# EasyEDA Pro project ProPrj_4pin风扇调速_2025-03-10.epro

# Schematic Schematic1
Create Date: 2024-08-04; Page Name: P1; Project Name: 4pin风扇调速; Schematic Name: Schematic1; Update Date: 2024-08-04
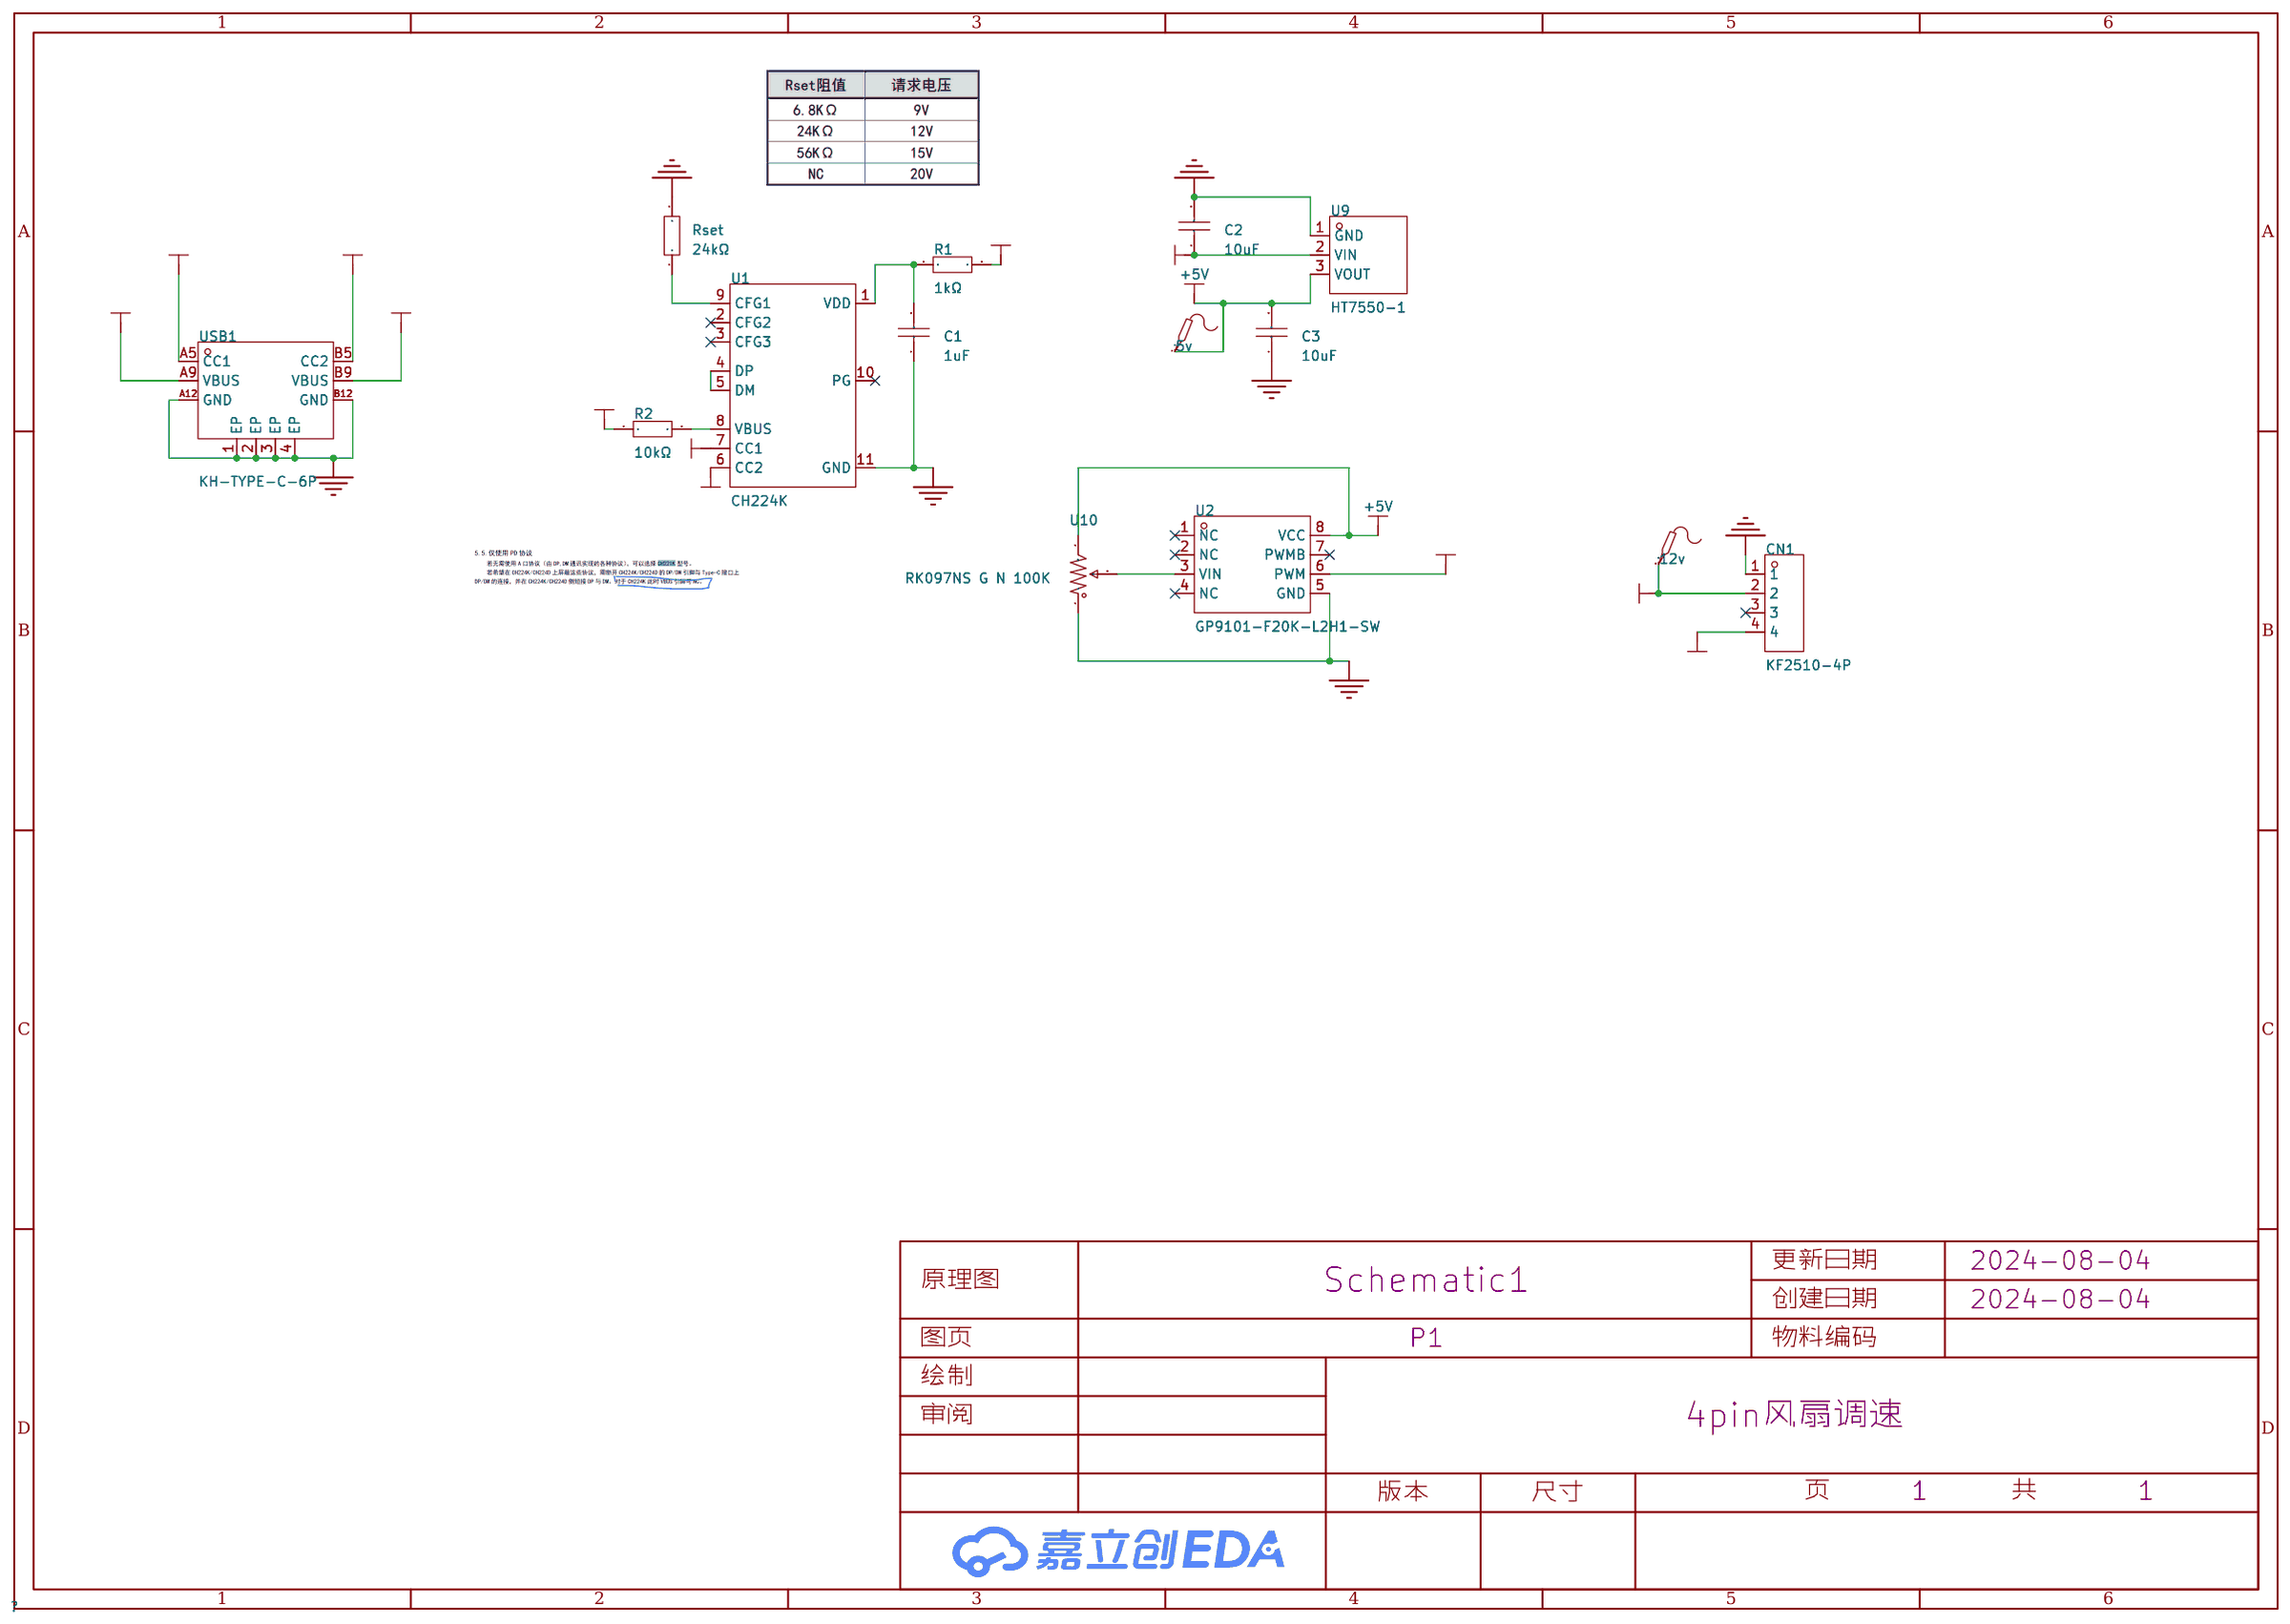
[diagram p0: schematic sheet]

## Parts
5v  -  [Test-Point-0.5mm]
12v  -  [Test-Point-0.5mm]
C1  1uF  [C0805]
C2  10uF  [C0805]
C3  10uF  [C0805]
CN1  KF2510-4P  [CONN-TH_KF2510-4P]
R1  1kΩ  [R0805]
R2  10kΩ  [R0805]
Rset  24kΩ  [R0805]
U1  CH224K  [ESSOP-10_L4.9-W3.9-P1.0-LS6.0-TL-EP]
U2  GP9101-F20K-L2H1-SW  [SOP-8_L4.9-W3.9-P1.27-LS6.0-BL]
U9  HT7550-1  [SOT-89_L4.5-W2.5-P1.50-LS4.2-BR]
U10  RK097NS G N 100K  [RES-ADJ-TH_RK097111080J]
USB1  KH-TYPE-C-6P  [TYPE-C-SMD_TYPE-C-31-M-16]

## Library data of the parts
5v 12v = Test-Point: Test Point 测试点
C1-C3 = CL21C200JBANNNC: 容值:20pF;精度:±5%;额定电压:50V;材质(温度系数):C0G;; LCSC Part Name: 20pF ±5% 50V; Supplier Part: C1798; Manufacturer: SAMSUNG(三星); Supplier Footprint: 0805; JLCPCB Part Class: 基础库; Datasheet: https://atta.szlcsc.com/upload/public/pdf/source/20160218/1457707763339.pdf; Supplier: LCSC; Tolerance: ±5%; Voltage Rated: 50V; Temperature Coefficient: C0G
CN1 = KF2510-4P: Supplier Part: C9900014236; JLCPCB Part Class: 扩展库; Supplier: LCSC
R1 R2 Rset = 0805W8F1502T5E: 电阻类型:厚膜电阻;阻值:15kΩ;精度:±1%;功率:125mW;最大工作电压:150V;温度系数:±100ppm/℃;; LCSC Part Name: 15kΩ ±1% 125mW 厚膜电阻; Supplier Part: C17475; Manufacturer: UNI-ROYAL(厚声); Supplier Footprint: 0805; JLCPCB Part Class: 基础库; Datasheet: https://atta.szlcsc.com/upload/public/pdf/source/20200306/C422600_1E6D84923E4A46A82E41ADD87F860B5C.pdf; Supplier: LCSC; Type: 厚膜电阻; Tolerance: ±1%; Power(Watts): 125mW; Overload Voltage (Max): 150V; Temperature Coefficient: ±100ppm/℃; Operating Temperature Range: -55℃~+155℃
U1 = CH224K: 应用功能:USB充电芯片;; LCSC Part Name: USB PD等多快充协议受电芯片CH224; Supplier Part: C970725; Manufacturer: WCH(南京沁恒); Supplier Footprint: ESSOP-10-150mil-1mm; JLCPCB Part Class: 扩展库; Datasheet: https://atta.szlcsc.com/upload/public/pdf/source/20240313/43C2AFDDBDD1F65B60386D2CCAB0811B.pdf; Supplier: LCSC; Applications Function: USB充电芯片
U2 = GP9101-F20K-L2H1-SW_C3020260: GP9101 0-VCC转PWM PWM频率 20KHz  输出特性 L2H1 ，占空比2%  拉低，占空比99% 拉高; Supplier Part: C3020260; Manufacturer: Guestgood(客益); Supplier Footprint: SOP-8; JLCPCB Part Class: 扩展库; Datasheet: https://atta.szlcsc.com/upload/public/pdf/source/20230324/347DFD6DABD5C2E507926BD64C336E27.pdf; Supplier: LCSC
U9 = HT7550-1_C347189: Supplier Part: C347189; Manufacturer: UMW(广东友台半导体); Supplier Footprint: SOT-89; JLCPCB Part Class: Extended Part; Datasheet: https://atta.szlcsc.com/upload/public/pdf/source/20181213/C347189_7863464AF9254DB9C48F57BD8F7C6DBD.pdf; Supplier: LCSC
U10 = RK097NS G N: Supplier Part: C9900057895; Supplier Footprint: 单联100k; Supplier: LCSC
USB1 = KH-TYPE-C-6P: 连接器类型:Type-C;标准:-;公母:母;端口数量:1;触点数量:6P;安装方式:卧贴;额定电流 - 电源:5A;工作温度范围:-25℃~+85℃;; LCSC Part Name: Type-C 母 卧贴; Supplier Part: C2926725; Manufacturer: kinghelm(金航标); Supplier Footprint: SMD; JLCPCB Part Class: 扩展库; Datasheet: https://atta.szlcsc.com/upload/public/pdf/source/20200722/C709355_1195801B3DE07627BE17E403420D896E.pdf; Supplier: LCSC; Connector Type: Type-C; Gender: 母; Number of Ports: 1; Number of Contacts: 6P; Mounting Style: 卧贴; Current Rating - Power (Max): 5A; Operating Temperature Range: -25℃~+85℃

## Nets
+5V: 5v.1 C3.2 U2.8(VCC) U9.3(VOUT) U10.3
GND: C1.1 C2.2 C3.1 CN1.1 Rset.2 U1.11(GND) U2.5(GND) U9.1(GND) U10.1 USB1.1(EP) USB1.2(EP) USB1.3(EP) USB1.4(EP) USB1.A12(GND) USB1.B12(GND)
VBUS: 12v.1 C2.1 CN1.2 R1.2 R2.1 U9.2(VIN) USB1.A9(VBUS) USB1.B9(VBUS)
CC1: U1.7(CC1) USB1.A5(CC1)
CC2: U1.6(CC2) USB1.B5(CC2)
PWM: CN1.4 U2.6(PWM)
$1N1061: U1.4(DP) U1.5(DM)
$1N1168: C1.2 R1.1 U1.1(VDD)
$1N1263: R2.2 U1.8(VBUS)
$1N1269: Rset.1 U1.9(CFG1)
$1N2096: U2.3(VIN) U10.2

Not connected (* = marked no-connect by the designer): CN1 3*; U1 2(CFG2)* 3(CFG3)* 10(PG)*; U2 1(NC)* 2(NC)* 4(NC)* 7(PWMB)*

# Board PCB1
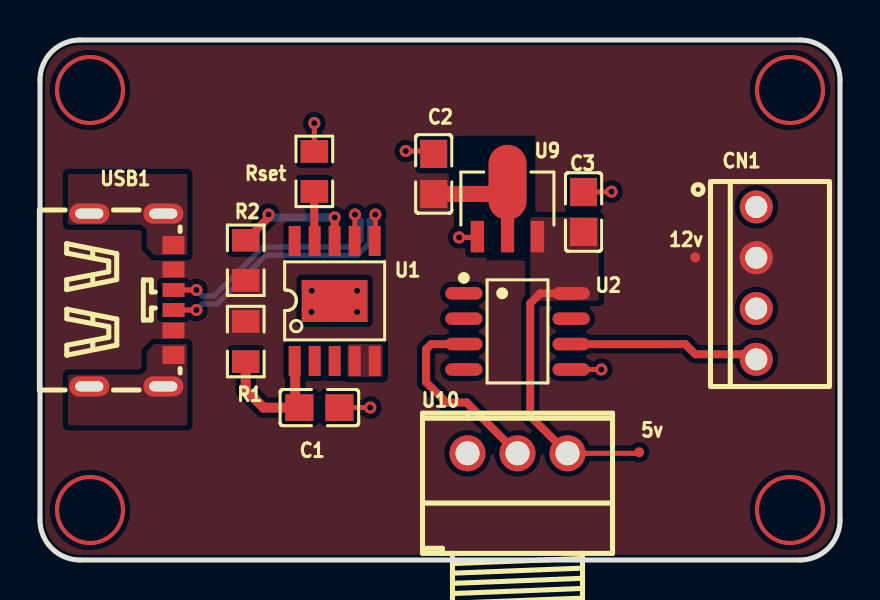
[diagram p1: board, top side]
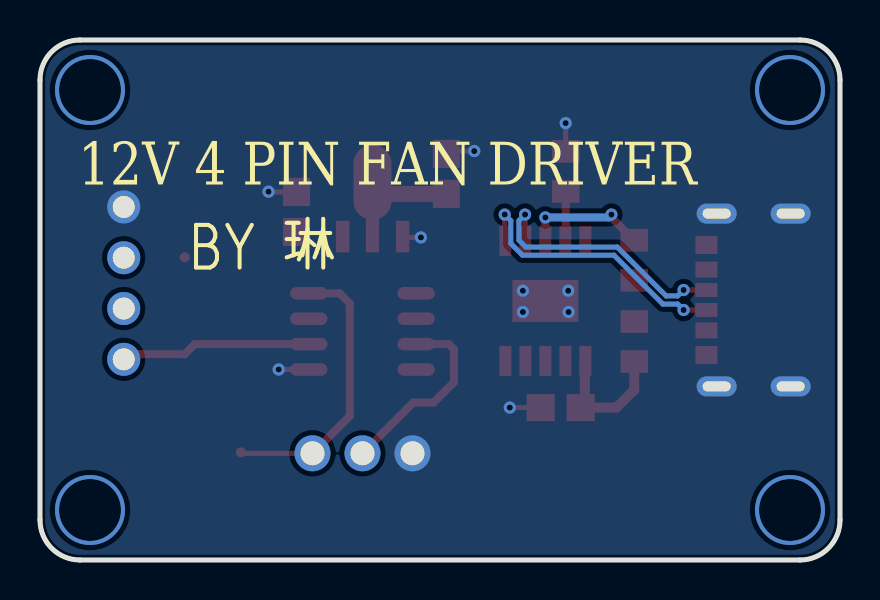
[diagram p2: board, bottom side, seen from below]

Outline 40 x 26 mm; copper layers: Top Layer, Bottom Layer. Coordinates in mm from the lower left corner of the outline.
Outline path: 0,24 0,2 arc(0.59,0.59) 2,0 38,0 arc(39.41,0.59) 40,2 40,24 arc(39.41,25.41) 38,26 2,26 arc(0.59,25.41) 0,24
Stack: Top Layer 0.035mm / Dielectric1 1.51mm FR4 er 4.5 / Bottom Layer 0.035mm

## Design rules (mm)
net CC1: DP1
net CC2: DP1
template: 自定义配置
spacing copperThickness1oz (default): track to track 0.102, other pairs 0.152 to 0.3
spacing copperThickness2oz: track to track 0.203, other pairs 0.152 to 0.3
track width copperThickness1oz (default): min 0.127, default 0.254, max 2.54
track width copperThickness2oz: min 0.203, default 0.254, max 2.54
differential pair differentialPair (default): width min 0.127, default 0.254, max 2.54; gap min 0.152, default 0.152
via viaSize (default): diameter min 0.5, default 0.61, max 10; hole min 0.3, default 0.305, max 6.3

## Placement (name value [footprint] x y rotation side)
5v  -  [Test-Point-0.5mm]  29.96 5.39 0 top
12v  -  [Test-Point-0.5mm]  32.76 15.14 0 top
C1  1uF  [C0805]  13.97 7.62 180 top
C2  10uF  [C0805]  19.69 19.3 90 top
C3  10uF  [C0805]  27.18 17.4 270 top
CN1  KF2510-4P  [CONN-TH_KF2510-4P]  35.81 13.84 270 top
R1  1kΩ  [R0805]  10.29 10.92 90 top
R2  10kΩ  [R0805]  10.29 14.99 90 top
Rset  24kΩ  [R0805]  13.72 19.43 90 top
U1  CH224K  [ESSOP-10_L4.9-W3.9-P1.0-LS6.0-TL-EP]  14.73 12.95 0 top
U2  GP9101-F20K-L2H1-SW  [SOP-8_L4.9-W3.9-P1.27-LS6.0-BL]  23.88 11.43 270 top
U9  HT7550-1  [SOT-89_L4.5-W2.5-P1.50-LS4.2-BR]  23.37 17.53 270 top
U10  RK097NS G N 100K  [RES-ADJ-TH_RK097111080J]  23.88 5.33 0 top
USB1  KH-TYPE-C-6P  [TYPE-C-SMD_TYPE-C-31-M-16]  4.57 13 270 top

## Footprints (pads in the part's own frame, mm; a bottom-side part is the same pattern mirrored in y, then rotated)
C0805
  rect 1.41x1.35 smd: 1(-1,0) 2(1,0)
CONN-TH_KF2510-4P
  round 1.65 hole 1.1: 1(-3.81,0) 2(-1.27,0) 3(1.27,0) 4(3.81,0)
ESSOP-10_L4.9-W3.9-P1.0-LS6.0-TL-EP
  rect 0.6x1.5 smd: 1(-2,-3) 2(-1,-3) 3(0,-3) 4(1,-3) 5(2,-3) 6(2,3) 7(1,3) 8(0,3) 9(-1,3) 10(-2,3)
  rect 3.3x2.1 smd: 11(0,0)
R0805
  rect 1.133x1.377 smd: 1(-1,0) 2(1,0)
RES-ADJ-TH_RK097111080J
  round 1.8 hole 1.2: 1(-2.5,0) 2(0,0) 3(2.5,0)
SOP-8_L4.9-W3.9-P1.27-LS6.0-BL
  oval 0.63x1.865 smd: 1(-1.905,-2.683) 2(-0.635,-2.683) 3(0.635,-2.683) 4(1.905,-2.683) 5(1.905,2.683) 6(0.635,2.683) 7(-0.635,2.683) 8(-1.905,2.683)
SOT-89_L4.5-W2.5-P1.50-LS4.2-BR
  rect 1.575x0.672 smd: 1(1.356,-1.5) 3(1.356,1.5)
  custom 5.377x1.9 smd: 2(-1.356,0.009)
Test-Point-0.5mm
  round 0.5 smd: 1(0,0)
TYPE-C-SMD_TYPE-C-31-M-16
  oval 1x2 hole 0.5x1.4: 1(-4.32,1.595) 2(4.32,1.595) 3(-4.32,-2.105) 4(4.32,-2.105)
  rect 0.7x1.1 smd: A5(-0.5,2.105) B5(0.5,2.105)
  rect 0.8x1.1 smd: A9(1.52,2.105) B9(-1.52,2.105)
  rect 0.9x1.1 smd: A12(2.75,2.105) B12(-2.75,2.105)

## Nets
As in the schematic.

Pads without a net: CN1 3; U1 2 3 10; U2 1 2 4 7

## Via types
v1: diameter 3.5, hole 3.1, Top Layer to Bottom Layer, 4 vias
v2: diameter 0.61, hole 0.305, Top Layer to Bottom Layer, 16 vias

## Routing (per net, layer and track width the routed paths; a pad name or vN(x,y) marks a point on that pad's centre or on a via; arc(x,y) is an arc through that point)
+5V: length 14.1
  Top Layer w0.254: U10.3 29.91,5.33 5v.1
  Top Layer w0.4: U2.8 25.02,13.33 24.51,12.83 24.51,7.2 U10.3
GND: length 8.3
  Top Layer w0.254: C2.2 19.54,20.45 v2(18.29,20.45) ; U9.1 21.83,16.13 v2(20.96,16.13) ; C1.1 v2(16.51,7.62) ; v2(28.57,18.42) 28.56,18.4 C3.1 ; v2(13.72,21.84) Rset.2 ; U2.5 v2(28.07,9.53)
  vias: v2(13.59,13.46) v2(13.57,12.4) v2(15.86,13.46) v2(15.86,12.4)
VBUS: length 3.9
  Top Layer w0.8: C2.1 22.8,18.3 U9.2
(no net):
  vias: v1(2.5,23.5) v1(2.5,2.5) v1(37.5,23.5) v1(37.5,2.5)
CC1: length 13.4
  Top Layer w0.254: U1.7 15.75,15.97 v2(15.75,17.27) ; USB1.A5 v2(7.82,13.5)
  Bottom Layer w0.254: v2(15.75,17.27) 16.05,16.97 16.05,15.99 15.71,15.65 11.13,15.65 8.69,13.2 8.12,13.2 v2(7.82,13.5)
CC2: length 14.1
  Top Layer w0.254: v2(16.76,17.27) 16.76,15.99 U1.6 ; USB1.B5 7.87,12.5
  Bottom Layer w0.254: v2(7.82,12.5) 8.12,12.8 8.86,12.8 11.3,15.24 15.88,15.24 16.46,15.82 16.46,16.97 v2(16.76,17.27)
PWM: length 9.6
  Top Layer w0.4: CN1.4 35.56,10.29 32.77,10.29 32.26,10.8 U2.6
$1N1168: length 6.8
  Top Layer w0.254: 12.73,7.64 12.71,7.62
  Top Layer w0.5: R1.1 10.29,8.51 11.18,7.62 C1.2 ; 12.73,7.64 12.76,7.67 12.76,9.93 U1.1
$1N1263: length 6.3
  Top Layer w0.4: v2(11.43,17.27) 11.43,17.13 R2.2 ; U1.8 v2(14.73,17.13)
  Bottom Layer w0.4: v2(11.43,17.27) 11.57,17.13 v2(14.73,17.13)
$1N1269: length 2.5
  Top Layer w0.4: Rset.1 13.72,15.97 U1.9
$1N2096: length 9.7
  Top Layer w0.4: U10.2 21.34,7.87 20.32,7.87 19.3,8.89 19.3,10.54 19.56,10.8 U2.3

## Copper pours and planes (outline as drawn; the poured copper is in the pictures)
+5V on Top Layer: 24.51,17.14 27.94,17.14 27.94,12.95 24.52,12.95 24.51,12.96
GND on Top Layer: 1.4,19.3 7.37,19.3 7.37,15.24 5.72,15.24 5.33,15.62 5.33,16.51 5.08,16.76 1.4,16.76
GND on Top Layer: 1.4,6.73 7.37,6.73 7.37,10.8 5.72,10.8 5.33,10.41 5.33,9.53 5.08,9.27 1.4,9.27
GND on Bottom Layer: -1.02,26.8 40.64,26.8 40.64,-0.13 -1.02,-0.13
VBUS on Top Layer: -0.63,26.92 41.15,26.92 41.15,-1.02 -0.63,-1.02
$1N1061 on Top Layer: 15.37,10.8 17.15,10.8 17.15,9.14 15.37,9.14

## Text on the board
Bottom Silkscreen Layer: 12V 4 PIN FAN DRIVER | BY 琳
